# EAGLE design geigerDC3 (EAGLE 9.3.0)
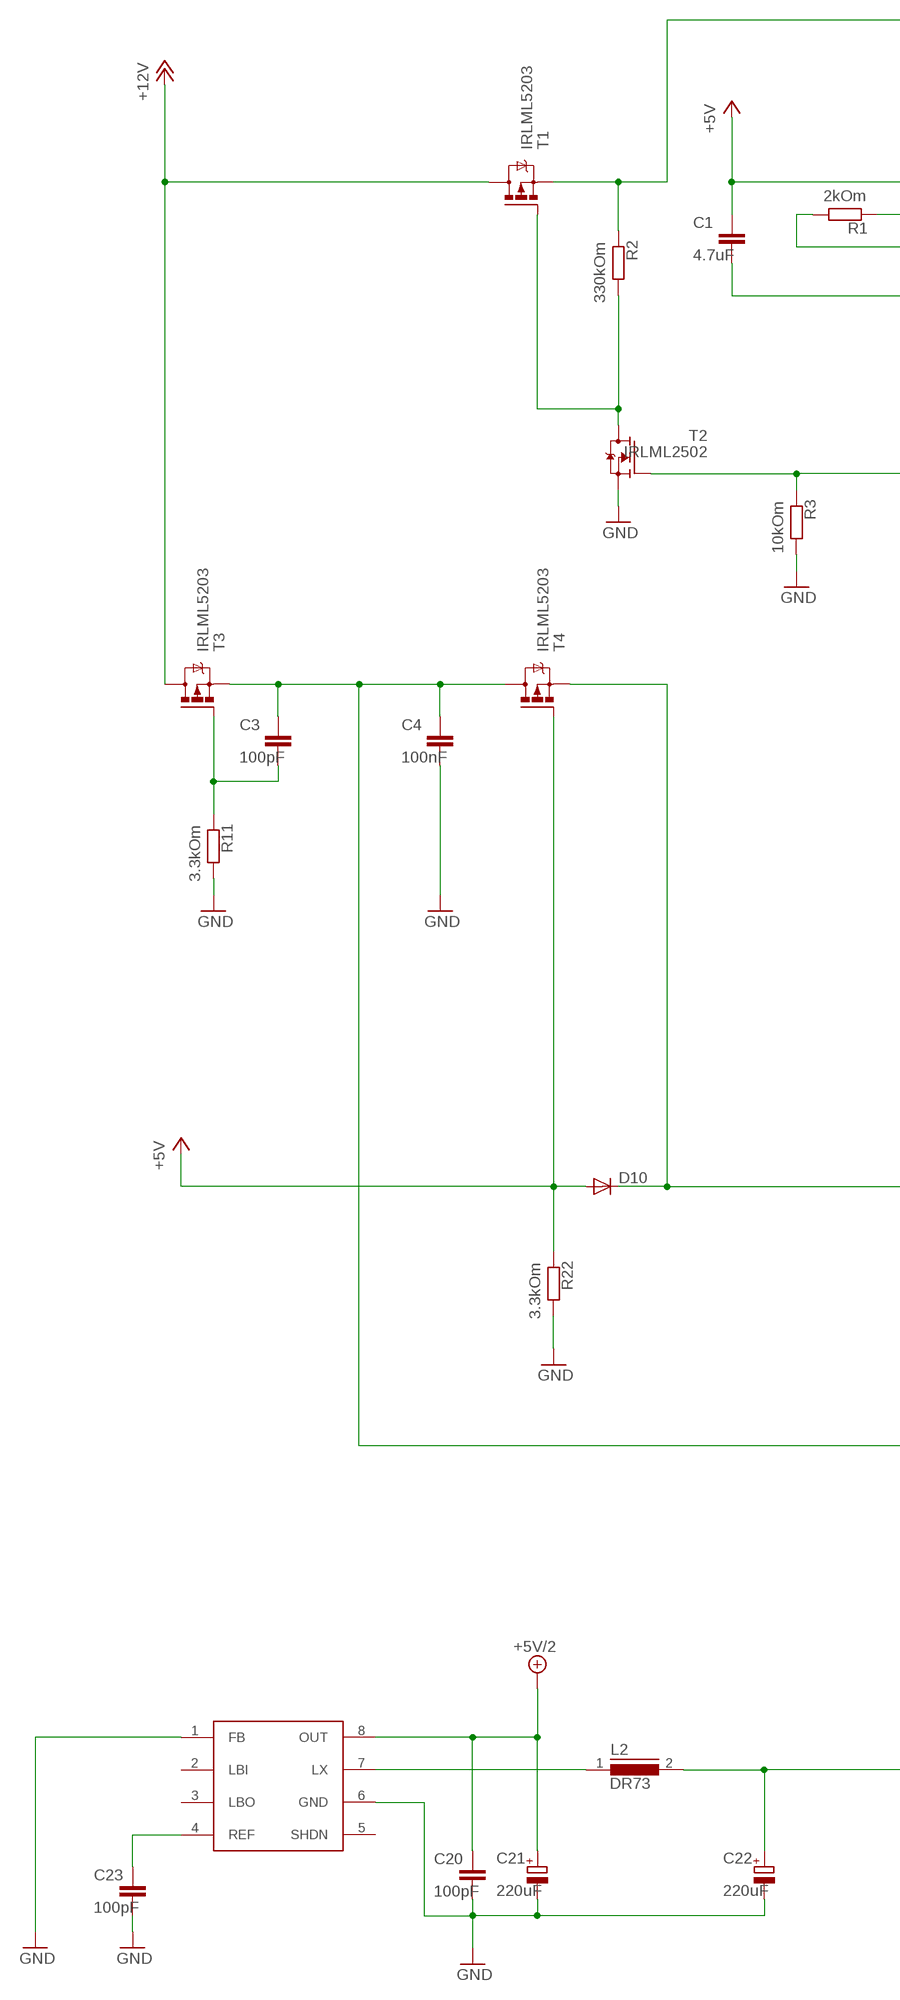
[diagram p0: schematic, sheet 1, part 1 of 3]
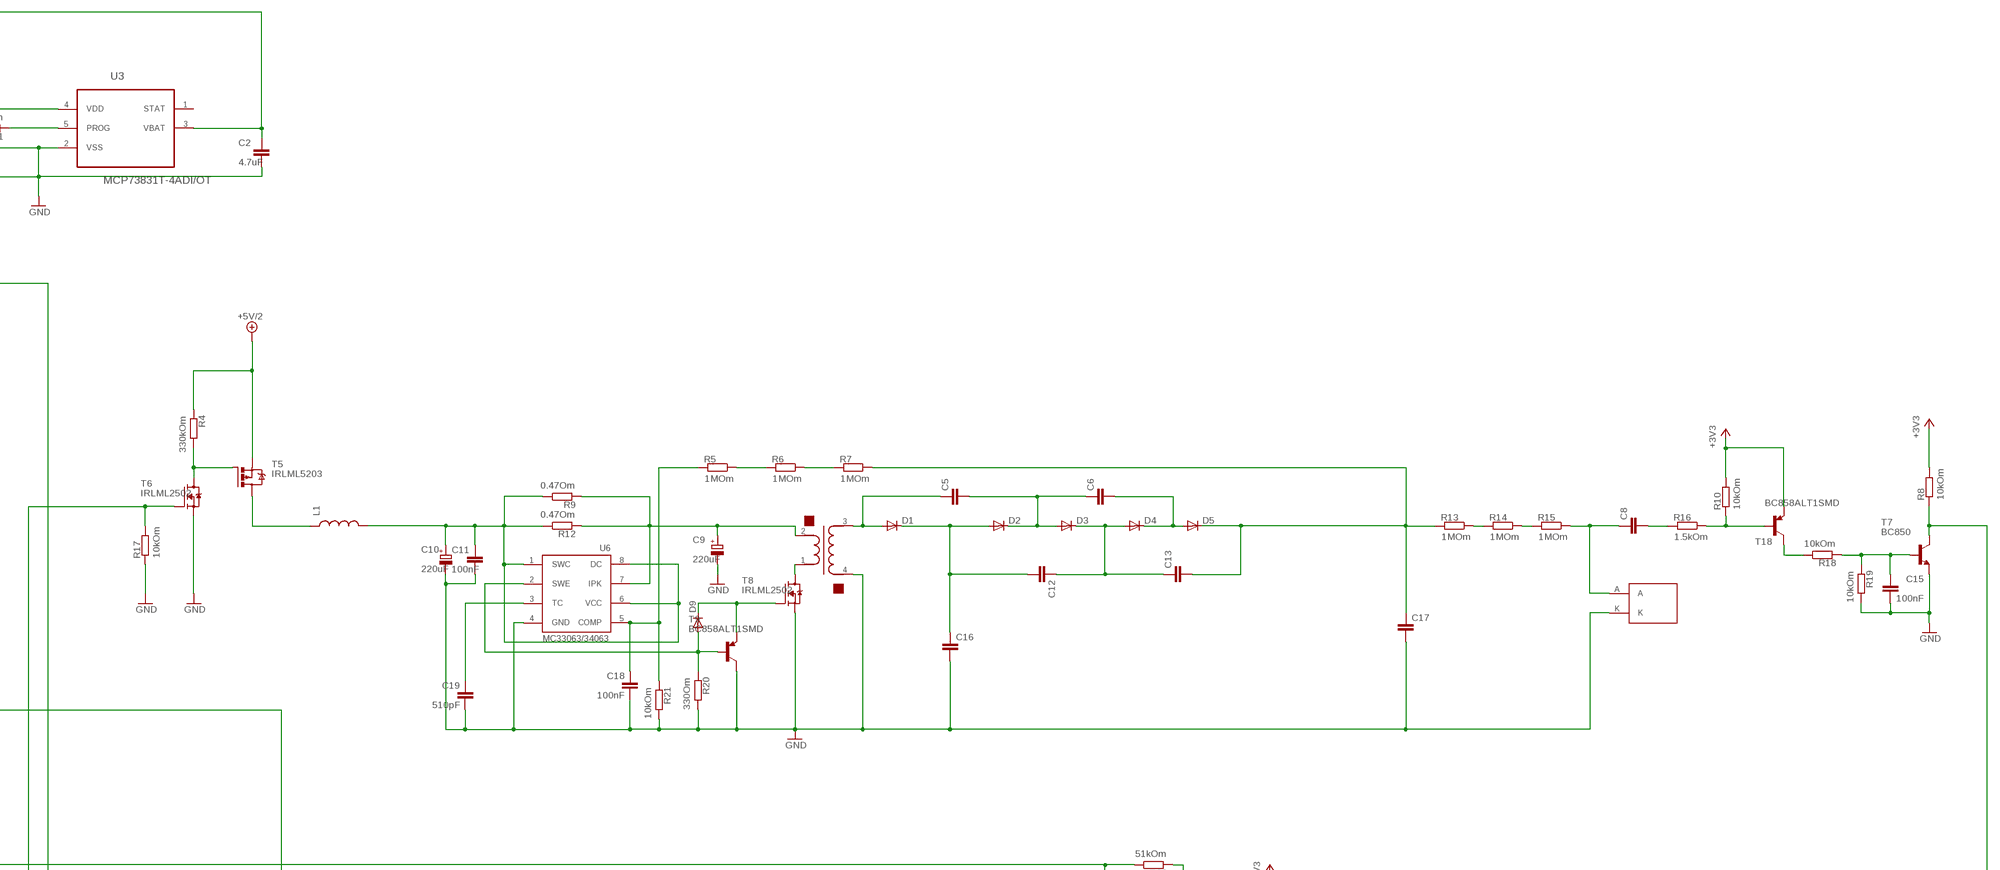
[diagram p1: schematic, sheet 1, part 2 of 3]
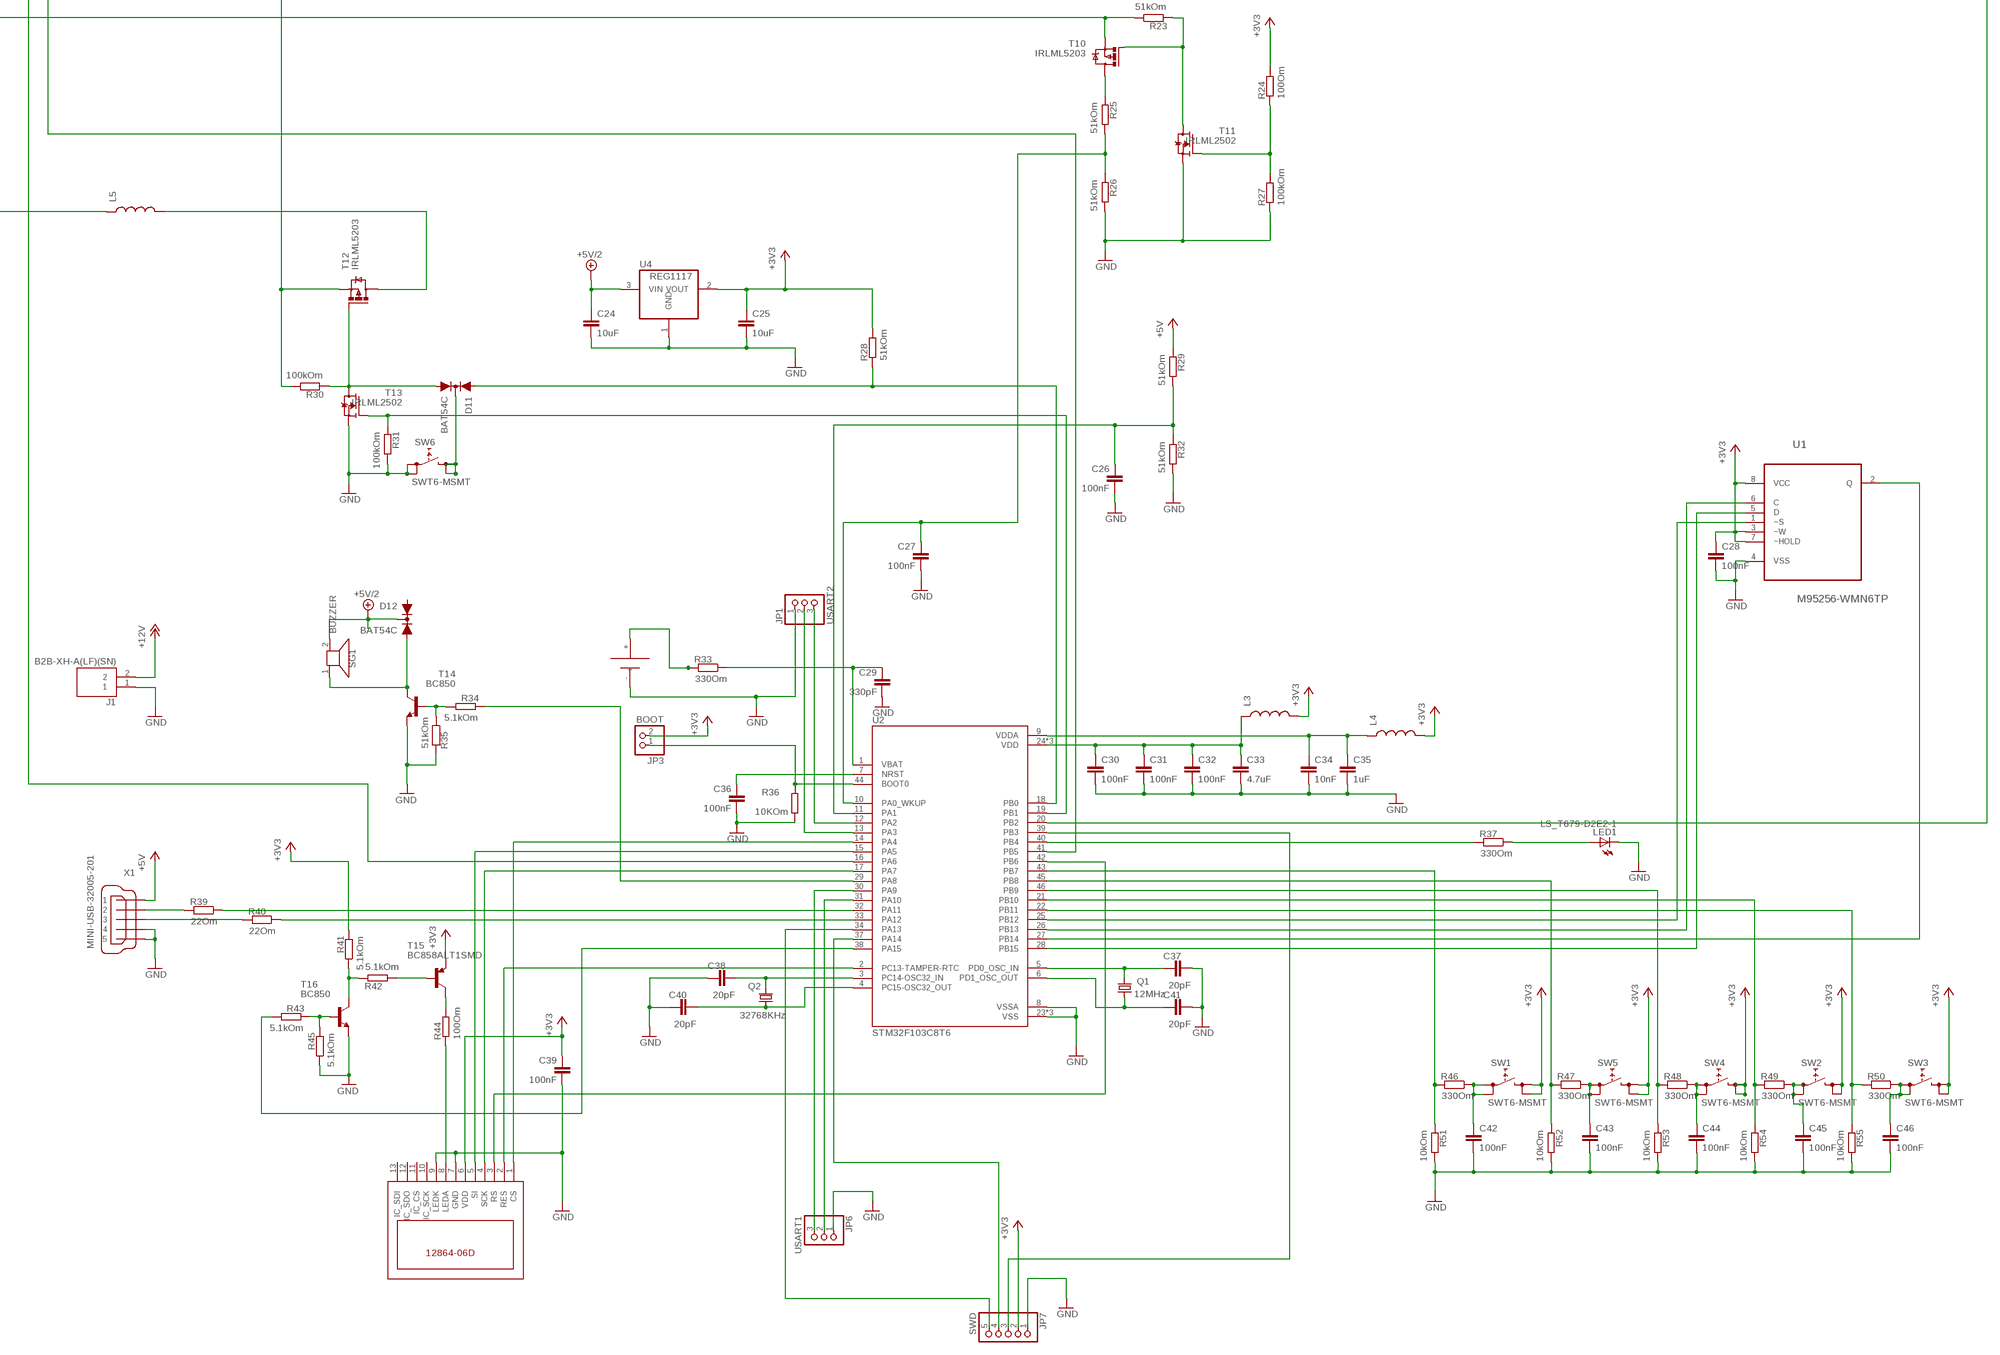
[diagram p2: schematic, sheet 1, part 3 of 3]

## Parts
C1  4.7uF  C-EUC0402  [C0402]
C2  4.7uF  C-EUC0402  [C0402]
C3  100pF  C-EUC0402  [C0402]
C4  100nF  C-EUC0402  [C0402]
C5  C-EUC2220K  [C2220K]
C6  C-EUC2220K  [C2220K]
C8  C-EU050-024X044  [C050-024X044]
C9  220uF  CPOL-EUC/6032-28W  [C/6032-28W]
C10  220uF  CPOL-EUC/6032-28W  [C/6032-28W]
C11  100nF  C-EUC0402  [C0402]
C12  C-EUC2220K  [C2220K]
C13  C-EUC2220K  [C2220K]
C15  100nF  C-EUC0402  [C0402]
C16  C-EUC2220K  [C2220K]
C17  C-EUC2220K  [C2220K]
C18  100nF  C-EUC0402  [C0402]
C19  510pF  C-EUC0402  [C0402]
C20  100pF  C-EUC0402  [C0402]
C21  220uF  CPOL-EUC/6032-28W  [C/6032-28W]
C22  220uF  CPOL-EUC/6032-28W  [C/6032-28W]
C23  100pF  C-EUC0402  [C0402]
C24  10uF  C-EUC0402  [C0402]
C25  10uF  C-EUC0402  [C0402]
C26  100nF  C-EUC0402  [C0402]
C27  100nF  C-EUC0402  [C0402]
C28  100nF  C-EUC0402  [C0402]
C29  330pF  C-EUC0402  [C0402]
C30  100nF  C-EUC0402  [C0402]
C31  100nF  C-EUC0402  [C0402]
C32  100nF  C-EUC0402  [C0402]
C33  4.7uF  C-EUC0402  [C0402]
C34  10nF  C-EUC0402  [C0402]
C35  1uF  C-EUC0402  [C0402]
C36  100nF  C-EUC0402  [C0402]
C37  20pF  C-EUC0402  [C0402]
C38  20pF  C-EUC0402  [C0402]
C39  100nF  C-EUC0402  [C0402]
C40  20pF  C-EUC0402  [C0402]
C41  20pF  C-EUC0402  [C0402]
C42  100nF  C-EUC0402  [C0402]
C43  100nF  C-EUC0402  [C0402]
C44  100nF  C-EUC0402  [C0402]
C45  100nF  C-EUC0402  [C0402]
C46  100nF  C-EUC0402  [C0402]
D1  DIODE-DO214BA  [DO214BA]
D2  DIODE-DO214BA  [DO214BA]
D3  DIODE-DO214BA  [DO214BA]
D4  DIODE-DO214BA  [DO214BA]
D5  DIODE-DO214BA  [DO214BA]
D9  DIODE-DO-214AC  [DO-214AC]
D10  DIODE-DO-214AC  [DO-214AC]
D11  BAT54C  [SOT23-R]
D12  BAT54C  [SOT23-R]
J1  B2B-XH-A(LF)(SN)  [JST_B2B-XH-A(LF)(SN)]
JP1  USART2  PINHD-1X3  [1X03]
JP3  BOOT  PINHD-1X2  [1X02]
JP6  USART1  PINHD-1X3  [1X03]
JP7  SWD  PINHD-1X5  [1X05]
L1  INDUCTOR0805  [0805]
L2  DR73  [DR73]
L3  INDUCTOR0805  [0805]
L4  INDUCTOR0805  [0805]
L5  INDUCTOR0805  [0805]
LED1  LS_T679-D2E2-1  [PLCC2]
Q1  12MHz  CRYSTALHC49UP  [HC49UP]
Q2  32768KHz  KX-327-S  [8.2X3.8]
R1  2kOm  R-EU_R0402  [R0402]
R2  330kOm  R-EU_R0402  [R0402]
R3  10kOm  R-EU_R0402  [R0402]
R4  330kOm  R-EU_R0402  [R0402]
R5  1MOm  R-EU_R0805  [R0805]
R6  1MOm  R-EU_R0805  [R0805]
R7  1MOm  R-EU_R0805  [R0805]
R8  10kOm  R-EU_R0402  [R0402]
R9  0.47Om  R-EU_R0805  [R0805]
R10  10kOm  R-EU_R0402  [R0402]
R11  3.3kOm  R-EU_R0402  [R0402]
R12  0.47Om  R-EU_R0805  [R0805]
R13  1MOm  R-EU_R0805  [R0805]
R14  1MOm  R-EU_R0805  [R0805]
R15  1MOm  R-EU_R0805  [R0805]
R16  1.5kOm  R-EU_R0402  [R0402]
R17  10kOm  R-EU_R0402  [R0402]
R18  10kOm  R-EU_R0402  [R0402]
R19  10kOm  R-EU_R0402  [R0402]
R20  330Om  R-EU_R0402  [R0402]
R21  10kOm  R-EU_R0805  [R0805]
R22  3.3kOm  R-EU_R0402  [R0402]
R23  51kOm  R-EU_R0402  [R0402]
R24  100Om  R-EU_R0402  [R0402]
R25  51kOm  R-EU_R0402  [R0402]
R26  51kOm  R-EU_R0402  [R0402]
R27  100kOm  R-EU_R0402  [R0402]
R28  51kOm  R-EU_R0402  [R0402]
R29  51kOm  R-EU_R0402  [R0402]
R30  100kOm  R-EU_R0402  [R0402]
R31  100kOm  R-EU_R0402  [R0402]
R32  51kOm  R-EU_R0402  [R0402]
R33  330Om  R-EU_R0402  [R0402]
R34  5.1kOm  R-EU_R0402  [R0402]
R35  51kOm  R-EU_R0402  [R0402]
R36  10KOm  R-EU_R0402  [R0402]
R37  330Om  R-EU_R0402  [R0402]
R39  22Om  R-EU_R0402  [R0402]
R40  22Om  R-EU_R0402  [R0402]
R41  5.1kOm  R-EU_R0402  [R0402]
R42  5.1kOm  R-EU_R0402  [R0402]
R43  5.1kOm  R-EU_R0402  [R0402]
R44  100Om  R-EU_R0805  [R0805]
R45  5.1kOm  R-EU_R0402  [R0402]
R46  330Om  R-EU_R0402  [R0402]
R47  330Om  R-EU_R0402  [R0402]
R48  330Om  R-EU_R0402  [R0402]
R49  330Om  R-EU_R0402  [R0402]
R50  330Om  R-EU_R0402  [R0402]
R51  10kOm  R-EU_R0402  [R0402]
R52  10kOm  R-EU_R0402  [R0402]
R53  10kOm  R-EU_R0402  [R0402]
R54  10kOm  R-EU_R0402  [R0402]
R55  10kOm  R-EU_R0402  [R0402]
SG1  BUZZER  [BUZZER]
SW1  SWT6-MSMT  [SWT6-M]
SW2  SWT6-MSMT  [SWT6-M]
SW3  SWT6-MSMT  [SWT6-M]
SW4  SWT6-MSMT  [SWT6-M]
SW5  SWT6-MSMT  [SWT6-M]
SW6  SWT6-MSMT  [SWT6-M]
T1  IRLML5203  [MICRO3]
T2  IRLML2502  [SOT23]
T3  IRLML5203  [MICRO3]
T4  IRLML5203  [MICRO3]
T5  IRLML5203  [MICRO3]
T6  IRLML2502  [SOT23]
T7  BC850  [SOT23]
T8  IRLML2502  [SOT23]
T9  BC858ALT1SMD  [SOT23-BEC]
T10  IRLML5203  [MICRO3]
T11  IRLML2502  [SOT23]
T12  IRLML5203  [MICRO3]
T13  IRLML2502  [SOT23]
T14  BC850  [SOT23]
T15  BC858ALT1SMD  [SOT23-BEC]
T16  BC850  [SOT23]
T18  BC858ALT1SMD  [SOT23-BEC]
TR1  TRANSFORMER  [TRANSFORMER]
TUBE  TUBE  [XH-B3B]
U1  M95256-WMN6TP  [SOIC127P600X175-8N]
U2  STM32F103C8T6  [QFP50P900X900X160-48N]
U3  MCP73831T-4ADI/OT  [SOT95P280X145-5N]
U4  REG1117  [SOT223]
U5  L6920DTR  [TSSOP8]
U6  MC33063/MC34063D  [SO08]
U$1  DS1092-10-W6L  [DS1092-10-W6L]
U$5  12864-06D  [12864-06D]
X1  MINI-USB-32005-201  [32005-201]

## Nets
+3V3: C25.1 C28.1 C39.1 JP3.2 JP7.2 L3.2 L4.2 R8.1 R10.1 R24.1 R28.1 R41.2 SW1.3 SW1.4 SW2.3 SW2.4 SW3.3 SW3.4 SW4.3 SW4.4 SW5.3 SW5.4 T15.E T18.E U1.3(~W) U1.7(~HOLD) U1.8(VCC) U4.2(VOUT) U$5.6(VDD)
+5V: C1.1 D10.2(A) R22.2 R29.2 T4.1(G) U3.4(VDD) X1.1
+5V/2: C20.1 C21.+ C24.1 D12.3(C) R4.2 SG1.2 T5.2(S) U4.3(VIN) U5.8(OUT)
+12V: J1.2 T1.3(D) T3.3(D)
GND: C1.2 C2.2 C4.2 C9.- C10.- C11.2 C15.2 C16.2 C17.2 C18.2 C19.2 C20.2 C21.- C22.- C23.2 C24.2 C25.2 C26.2 C27.2 C28.2 C29.2 C30.2 C31.2 C32.2 C33.2 C34.2 C35.2 C36.2 C37.2 C38.1 C39.2 C40.1 C41.2 C42.2 C43.2 C44.2 C45.2 C46.2 J1.1 JP1.1 JP6.1 JP7.1 LED1.C R1.1 R3.1 R11.1 R17.2 R19.1 R20.1 R21.1 R22.1 R26.1 R27.2 R31.1 R32.1 R35.2 R36.1 R45.1 R51.1 R52.1 R53.1 R54.1 R55.1 SW6.1 SW6.2 T2.2(S) T6.2(S) T7.2(E) T8.2(S) T9.C T11.2(S) T13.2(S) T14.2(E) T16.2(E) TR1.4 TUBE.K U1.4(VSS) U2.8(VSSA) U2.23(VSS) U2.35(VSS) U2.47(VSS) U3.2(VSS) U4.1(GND) U5.1(FB) U5.6(GND) U6.4(GND) U$1.- U$5.7(GND) U$5.9(LEDK) X1.4 X1.5
N$1: C30.1 C31.1 C32.1 C33.1 L3.1 U2.24(VDD) U2.36(VDD) U2.48(VDD)
N$2: C41.1 Q1.1 U2.6(PD1_OSC_OUT)
N$3: C34.1 C35.1 L4.1 U2.9(VDDA)
N$4: C37.1 Q1.2 U2.5(PD0_OSC_IN)
N$5: C38.2 Q2.4 U2.3(PC14-OSC32_IN)
N$6: C36.1 U2.7(NRST)
N$7: C40.2 Q2.1 U2.4(PC15-OSC32_OUT)
N$8: C29.1 R33.1 U2.1(VBAT)
N$9: JP3.1 R36.2 U2.44(BOOT0)
N$10: R33.2 U$1.+
N$11: R40.1 U2.33(PA12)
N$12: R39.1 U2.32(PA11)
N$13: R39.2 X1.2
N$14: R40.2 X1.3
N$15: C2.1 R2.2 T1.2(S) U3.3(VBAT)
N$16: R31.2 T13.1(G) U2.19(PB1)
N$17: D11.2(A2) R30.2 T12.1(G) T13.3(D)
N$18: D11.3(C) SW6.3 SW6.4
N$19: D11.1(A1) R28.2 U2.18(PB0)
N$20: R3.2 T2.1(G) U2.41(PB5)
N$21: C3.2 R11.2 T3.1(G)
N$22: D10.1(C) R30.1 T4.2(S) T12.2(S)
N$23: L1.1 T5.3(D)
N$24: C3.1 C4.1 R23.1 T3.2(S) T4.3(D) T10.2(S)
N$25: C10.+ C11.1 L1.2 R9.1 R12.1 U6.1(SWC) U6.6(VCC) U6.8(DC)
N$26: C13.2 C17.1 D5.C R7.1 R13.2
N$27: C9.+ R9.2 R12.2 TR1.2 U6.7(IPK)
N$28: R4.1 T5.1(G) T6.3(D)
N$29: D9.1(C) T8.1(G) T9.E
N$30: T8.3(D) TR1.1
N$31: R17.1 T6.1(G) U2.16(PA6)
N$32: C18.1 R5.2 R21.2 U6.5(COMP)
N$33: C5.1 D1.A TR1.3
N$34: D9.2(A) R20.2 T9.B U6.2(SWE)
N$35: R5.1 R6.2
N$36: R6.1 R7.2
N$37: R44.2 U$5.8(LEDA)
N$38: C43.1 R47.1 SW5.1 SW5.2
N$39: R24.2 R27.1 T11.1(G)
N$40: C19.1 U6.3(TC)
N$41: JP6.2 U2.31(PA10)
N$42: C27.1 R25.1 R26.2 U2.10(PA0_WKUP)
N$43: R23.2 T10.1(G) T11.3(D)
N$44: R2.1 T1.1(G) T2.3(D)
N$46: C12.2 C16.1 D1.C D2.A
N$47: C5.2 C6.1 D2.C D3.A
N$48: C12.1 C13.1 D3.C D4.A
N$49: C6.2 D4.C D5.A
N$50: C44.1 R48.1 SW4.1 SW4.2
N$52: JP1.3 U2.12(PA2)
N$53: JP1.2 U2.13(PA3)
N$54: R25.2 T10.3(D)
N$55: JP6.3 U2.30(PA9)
N$58: R13.1 R14.2
N$59: R14.1 R15.2
N$60: C8.1 R15.1 TUBE.A
N$61: C8.2 R16.2
N$62: R10.2 R16.1 T18.B
N$63: JP7.5 U2.34(PA13)
N$64: R18.1 T18.C
N$65: C15.1 R18.2 R19.2 T7.1(B)
N$66: R8.2 T7.3(C) U2.20(PB2)
N$67: JP7.4 U2.37(PA14)
N$68: JP7.3 U2.39(PB3)
N$69: U1.5(D) U2.28(PB15)
N$70: U1.2(Q) U2.27(PB14)
N$71: U1.6(C) U2.26(PB13)
N$72: R49.2 R54.2 U2.21(PB10)
N$73: C46.1 R50.1 SW3.1 SW3.2
N$74: U1.1(~S) U2.25(PB12)
N$76: C45.1 R49.1 SW2.1 SW2.2
N$77: C42.1 R46.1 SW1.1 SW1.2
N$78: C26.1 R29.1 R32.2 U2.11(PA1)
N$79: R46.2 R51.2 U2.43(PB7)
N$80: R47.2 R52.2 U2.45(PB8)
N$81: R48.2 R53.2 U2.46(PB9)
N$83: R50.2 R55.2 U2.22(PB11)
N$84: R34.2 U2.29(PA8)
N$85: D12.2(A2) SG1.1 T14.3(C)
N$86: U2.14(PA4) U$5.1(CS)
N$87: R34.1 R35.1 T14.1(B)
N$88: U2.15(PA5) U$5.5(SI)
N$89: U2.17(PA7) U$5.4(SCK)
N$90: R44.1 T15.C
N$91: C22.+ L2.2 L5.1
N$92: R42.1 T15.B
N$93: R41.1 R42.2 T16.3(C)
N$94: R37.2 U2.40(PB4)
N$95: R43.2 R45.2 T16.1(B)
N$96: LED1.A R37.1
N$97: R43.1 U2.38(PA15)
N$98: U2.2(PC13-TAMPER-RTC) U$5.2(RES)
N$99: U2.42(PB6) U$5.3(RS)
N$100: R1.2 U3.5(PROG)
N$101: C23.1 U5.4(REF)
N$105: L2.1 U5.7(LX)
N$108: L5.2 T12.3(D)
Unconnected: D12.1(A1) U3.1(STAT) U5.2(LBI) U5.3(LBO) U5.5(SHDN) U$5.10(IC_SCK) U$5.11(IC_CS) U$5.12(IC_SDO) U$5.13(IC_SDI)

## Library data of the parts
C1-C4 C8 C11 C15 C18-C20 C23-C46 = rcl:C-EU: CAPACITOR, European symbol; SPICEPREFIX: C
C5 C6 C12 C13 C16 C17 = rcl:C-EU: CAPACITOR, European symbol
C9 C10 C21 C22 = rcl:CPOL-EU: POLARIZED CAPACITOR, European symbol
D1-D5 = diode:DIODE-: DIODE
D9 D10 = dp_devices:DIODE: Various Diode Packages
D11 D12 = BAT54C:BAT54C: BAT54C Schottky Diodes (Common Cathode) 30V 200mA, SOT-23 Package Digikey: BAT54CFSCT-ND; AVAILABILITY: Unavailable; DESCRIPTION: Diode Array 1 Pair Common Cathode Schottky 30V 200mA Surface Mount TO-236-3, SC-59, SOT-23-3; MF: ON Semiconductor; MP: BAT54C; PACKAGE: SOT-23-3 ON Semiconductor; PRICE: None
J1 = B2B-XH-A_LF__SN_:B2B-XH-A(LF)(SN): XH Series 2 Position 2.5 mm Pitch Through Hole Top Entry Shrouded Header; AVAILABILITY: Unavailable; DESCRIPTION: Connector Header Through Hole 2 position 0.098 _2.50mm_; MF: JST Sales; MP: B2B-XH-A_LF__SN_; PACKAGE: None; PRICE: None
JP1 JP6 = pinhead:PINHD-1X3: PIN HEADER
JP3 = pinhead:PINHD-1X2: PIN HEADER
JP7 = pinhead:PINHD-1X5: PIN HEADER
L1 L3-L5 = SparkFun:INDUCTOR: Inductors Basic Inductor/Choke - 0603 and 1206. Footprints are not proven and vary greatly between part numbers.
L2 = inductors:DR73: High Power Density, High Efficiency, Shielded Inductors Source: coiltronics_dr_series.pdf; SPICEPREFIX: L
LED1 = led:*_T679-?-1: LC TOPLED® Low Current LED Source: http://catalog.osram-os.com .. LG_LS_LY_T679_OBS.pdf; COLOR: super-red
Q1 = crystal:CRYSTAL: CRYSTAL; OC_FARNELL: unknown; OC_NEWARK: unknown
Q2 = crystal-geyer_V1_0:KX-327: Tuning Fork Crystals (kHz) SMD: KX327 - Serie Model Size l/w/h [mm] Frequency Range Frequency Stability Temp. Range [°C] Load Capacitance AECQ 200 availabel Datasheet KX-327VT KX-327FT KX-327RT KX-327NHT KX-327NHF KX-327L KX-327S 1.25/1.05/0.5 1.6/1.0/0.5 2.0/1.2/0.6 3.2/1.5/0.8 3.2/1.5/0.8 7.0/1.5/1.4 8.2/3.8/2.5 32,768 kHz 32,768 kHz 32,768 kHz 32,768 kHz 32,768 kHz 32,768 kHz 32,768 kHz ±10 … ±20ppm ±10 … ±20ppm ±10 … ±20ppm ±10 … ±20ppm ±10 … ±20ppm ±10 … ±20ppm ±5 … ±20ppm (*) -40°C …+85°C (*) -40°C …+85°C (*) -40°C …+85°C (*) -40°C …+85°C (*) -40°C …+125°C (*) -40°C …+85°C (*) -40°C …+85°C 7/9/12,5 7/9/12,5 7/9/12,6 7/9/12,5 9/12,5 7/9/12,5 6/12,5 - - - - yes - - KX-327VT.pdf <http://www.geyer-electronic.de/uploads/tx_userartikelfrequenz/GEYER-KX-327VT.pdf> KX-327FT.pdf <http://www.geyer-electronic.de/uploads/tx_userartikelfrequenz/GEYER-KX-327FT.pdf> KX-327RT.pdf <http://www.geyer-electronic.de/uploads/tx_userartikelfrequenz/GEYER-KX-327RT.pdf> KX-327NHT.pdf <http://www.geyer-electronic.de/uploads/tx_userartikelfrequenz/GEYER-KX-327NHT.pdf> KX-327NHF.pdf <http://www.geyer-electronic.de/uploads/tx_userartikelfrequenz/GEYER-KX-327NHF.pdf> KX-327L.pdf <http://www.geyer-electronic.de/uploads/tx_userartikelfrequenz/GEYER-KX-327L.pdf> KX-327S.pdf <http://www.geyer-electronic.de/uploads/tx_userartikelfrequenz/GEYER-KX-327S.pdf> <http://www.geyer-electronic.de/fileadmin/template/img/logo-geyer-electronic.png> Details see: http://www.geyer-electronic.de/Frequenz-Produkte.9.0.html Created 2016-06-07, Hans Locher 2016 (C) Geyer Quartz Technology KX327VT,KX327FT,KX327RT,KX327NHT,KX327NHF,KX327S,KX327L;125105;1610;2012;3215;7015;8238;1,25x1,05,1.25x1.05;1,6x1,0,1.6x1.0;2,0x1,2,2.0x1.2;3,2x1,5,3.2x1.5;8,2x3,8,8.2x3.8,7.0x1.5,7,0x1,532.768kHz
R1-R4 R8 R10 R11 R16-R20 R22-R37 R39-R43 R45-R55 = rcl:R-EU_: RESISTOR, European symbol; SPICEPREFIX: R
R5-R7 R9 R12-R15 R21 R44 = rcl:R-EU_: RESISTOR, European symbol
SG1 = buzzer:BUZZER
SW1-SW6 = tactile_switch:SWT6-M
T1 T3-T5 T10 T12 = transistor-power:IRLML5203: HEXFET P-Channel Power MOSFET
T2 T6 T8 T11 T13 = IRLML2502:IRLML2502; AVAILABILITY: Unavailable; DESCRIPTION: N-Channel 20V 4.2A _Ta_ 1.25W _Ta_ Surface Mount Micro3™/SOT-23; MF: Infineon Technologies; MP: IRLML2502; PACKAGE: SOT-23-3 International Rectifier; PRICE: None
T7 T14 T16 = transistor:BC850: NPN TRANSISTOR
T9 T15 T18 = transistor-pnp:BC858*: PNP Transistror
TR1 = transformer:TRANSFORMER
TUBE = XH:TUBE
U1 = M95256-WMN6TP:M95256-WMN6TP: EEPROM; AVAILABILITY: Unavailable; DESCRIPTION: EEPROM Serial-SPI 256K-bit 32K x 8 3.3V/5V 8-Pin SO N T/R; MF: STMicroelectronics; MP: M95256-WMN6TP; PACKAGE: SO-8 STMicroelectronics; PRICE: None
U2 = STM32F103C8T6:STM32F103C8T6: Mainstream Performance line, ARM Cortex-M3 MCU with 64 Kbytes Flash, 72 MHz CPU, motor control, USB and CAN; AVAILABILITY: Unavailable; DESCRIPTION: ARM® Cortex®-M3 STM32F1 Microcontroller IC 32-Bit 72MHz 64KB _64K x 8_ FLASH; MF: STMicroelectronics; MP: STM32F103C8T6; PACKAGE: LQFP-48 STMicroelectronics; PRICE: None
U3 = MCP73831T-4ADI_OT:MCP73831T-4ADI/OT: Charge Management Controller; AVAILABILITY: Unavailable; DESCRIPTION: Charger IC Lithium Ion/Polymer SOT-23-5; MF: Microchip; MP: MCP73831T-4ADI/OT; PACKAGE: SOT-23-5 Microchip; PRICE: None
U4 = burr-brown:REG1117: 800mA and 1A Low Dropout (LDO) Positive Regulator 1.8V, 2.5V, 2.85V, 3.3V, 5V, and Adj; MPN: REG1117; OC_FARNELL: 1097566; OC_NEWARK: 14P6981
U5 = L6902DTR:L6920DTR
U6 = adafruit:MC33063/MC34063: MC33063 and MC34063 Basic DC/DC converter with internal power-NPN transistor, 100KHz, 1.5A peak switch current. 3-40 input/output.
U$1 = batteries:DS1092-10-W6L
U$5 = 12864-06D:12864-06D
X1 = con-cypressindustries:MINI-USB-: MINI USB-B Conector Source: www.cypressindustries.com; OC_FARNELL: unknown; OC_NEWARK: unknown

## Board
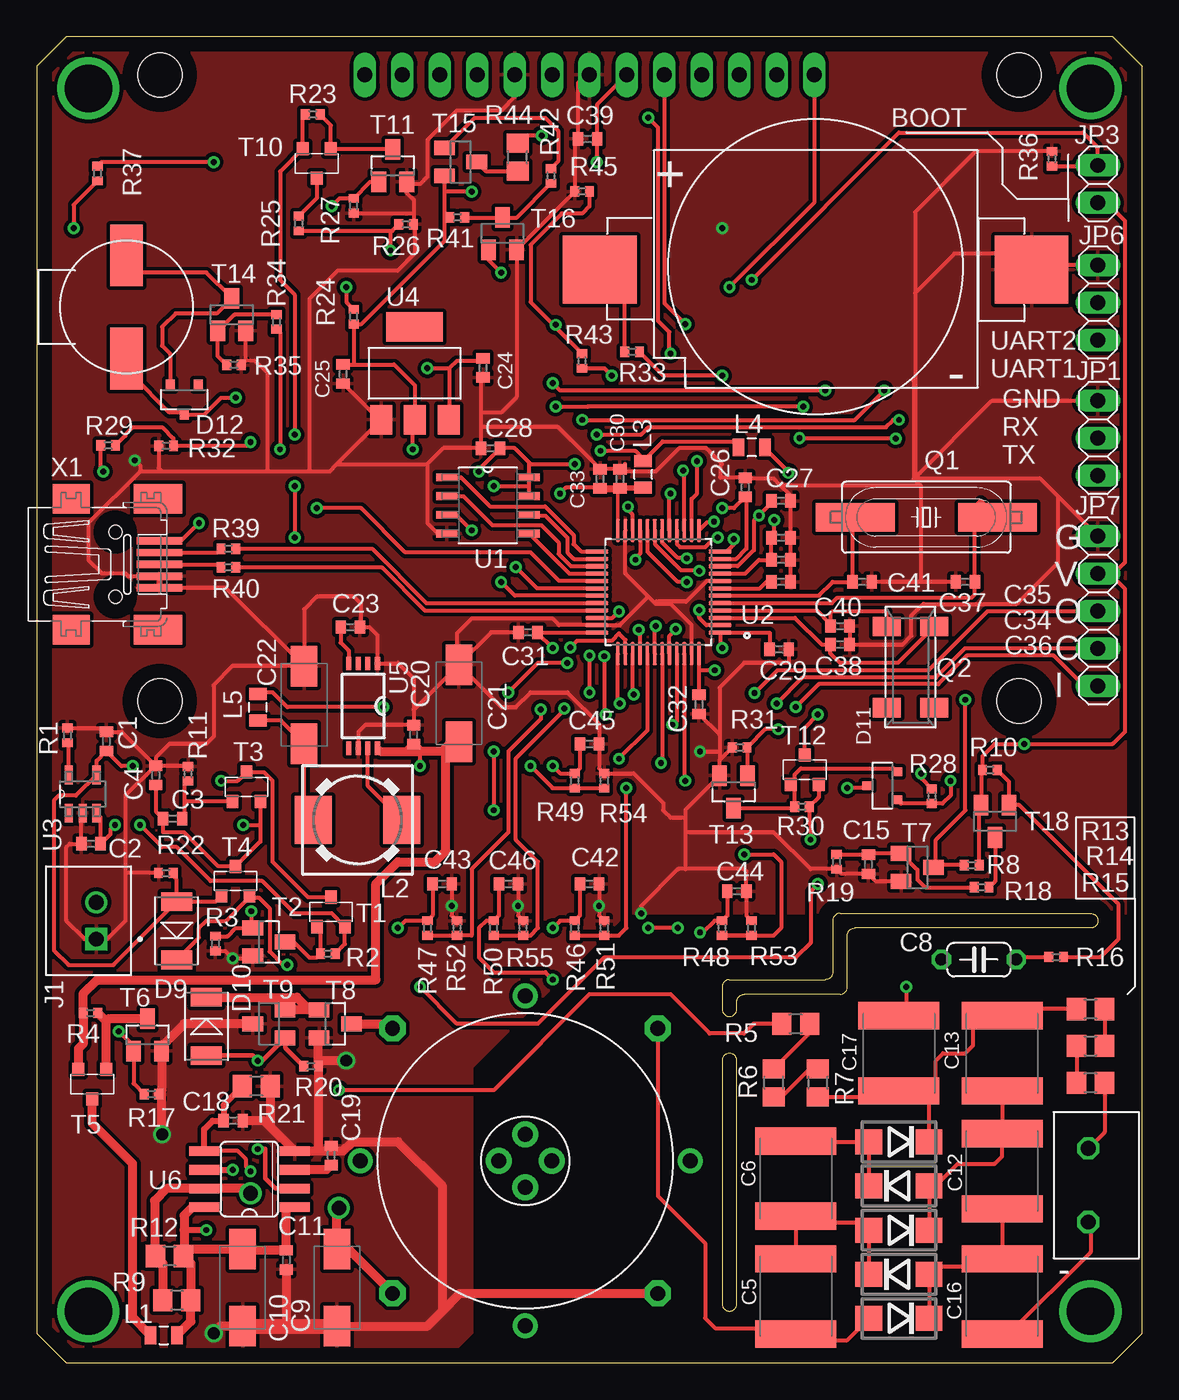
[diagram p3: board, top side]
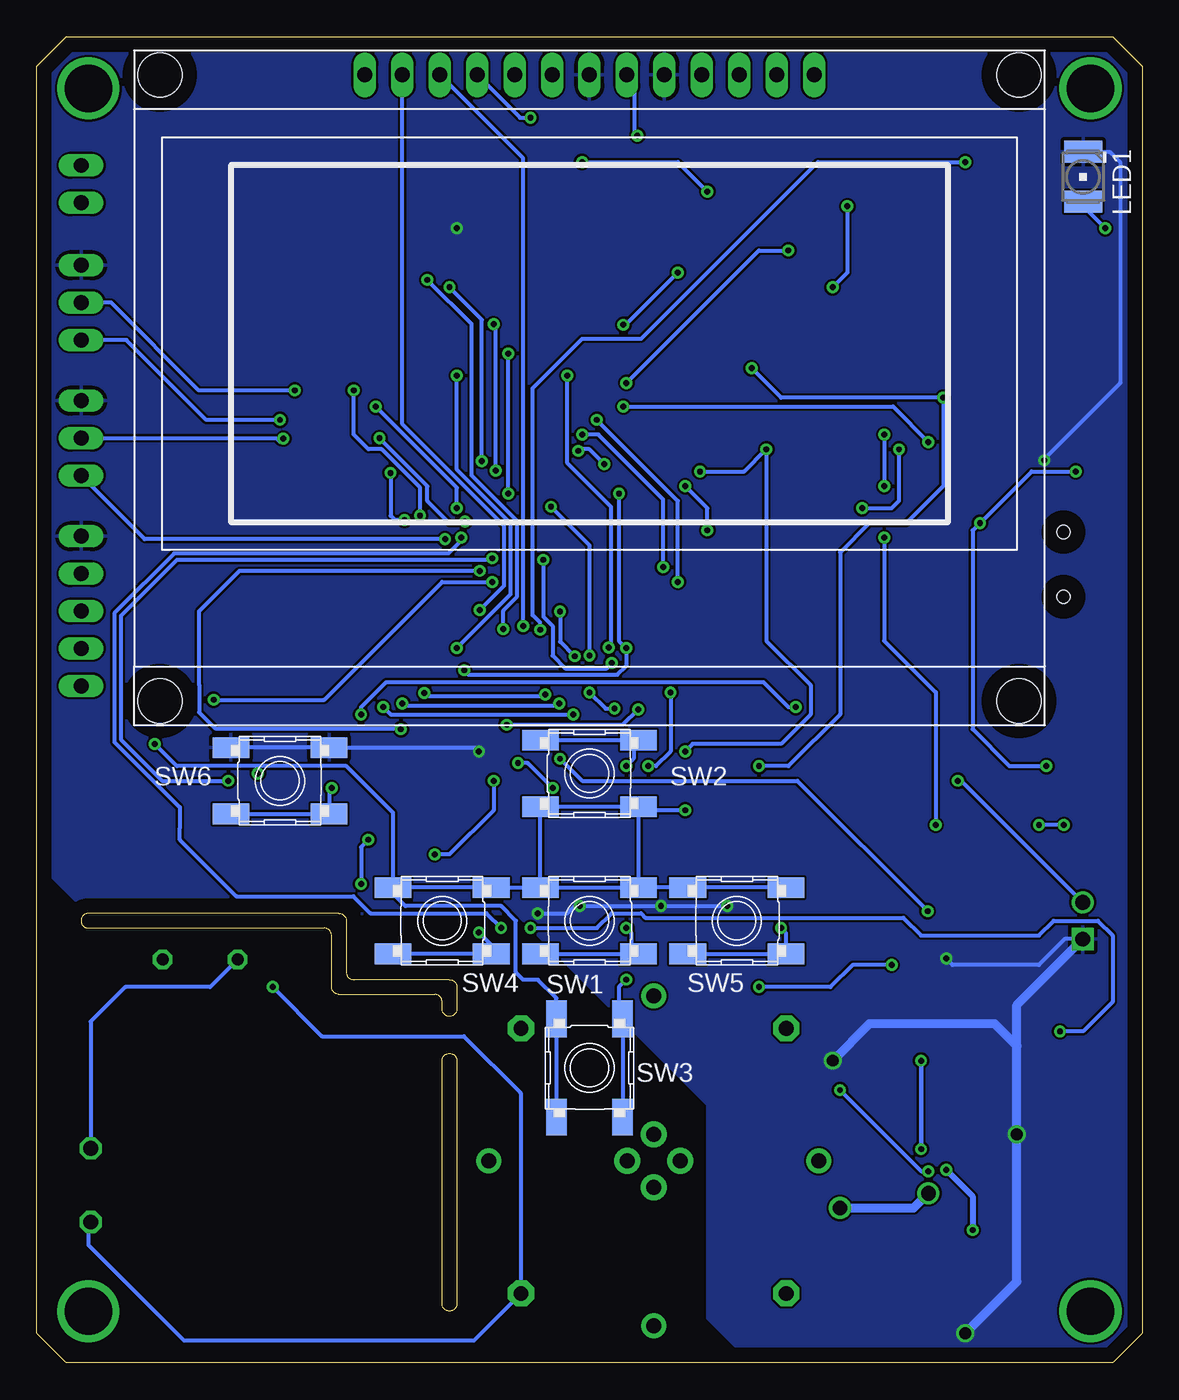
[diagram p4: board, bottom side, seen from below]

Size 75 x 90 mm. Coordinates in mm from the lower left corner, seen from the top.
Outline: 2,0 73,0 75,2 75,88 73,90 2,90 0,88 0,2 2,0
Outline: 46.5,20.5 46.5,4 arc180 47.5,4 47.5,20.5 arc180 46.5,20.5
Outline: 47,26 53.5,26 arc90 54,26.5 54,30 arc-90 54.5,30.5 71.5,30.5 arc-180 71.5,29.5 55.5,29.5 arc90 55,29 55,25.5 arc-90 54.5,25 48,25 arc90 47.5,24.5 47.5,24 arc-90 47,23.5 arc-90 46.5,24 46.5,25.5 arc-90 47,26
Copper layers (1*16): Top 0.035mm / dielectric 1.5mm / Bottom 0.035mm
Design rules "default": minimum track width 6mil, minimum drill 0.35mm, track to track 6mil, track to pad 6mil, pad to pad 6mil, via to via 6mil, smd to smd 6mil, copper to edge 40mil, drill to drill 6mil, minimum pad ring 10mil, minimum via ring 8mil, stop-mask expansion 4mil, vias tented up to drill 0mil, thermal gap 10mil

### Footprints (pad centres in the part's own frame; a part is rotated, then mirrored left to right if it is on the bottom)
C0402 = smd 0.7 x 0.9: 1 -0.65,0; 2 0.65,0
C2220K = smd 1.85 x 5.5: 1 -2.55,0; 2 2.55,0
C050-024X044 = drill 0.813 octagon: 1 -2.54,0; 2 2.54,0
C/6032-28W = smd 2.75 x 1.8: + 2.625,0; - -2.625,0
DO214BA = smd 1.8 x 1.7: A 2.05,0; C -2.05,0
DO-214AC = smd 1.27 x 2.1: 1 -1.98,0; 2 1.98,0
SOT23-R = smd 0.6 x 0.7: 1 -0.95,-1; 2 0.95,-1; 3 0,1
JST_B2B-XH-A(LF)(SN) = drill 1 square: 1 -1.25,-0.525 | drill 1: 2 1.25,-0.525
1X03 = drill 1.016 long: 1 -2.54,0; 2 0,0; 3 2.54,0
1X02 = drill 1.016 long: 1 -1.27,0; 2 1.27,0
1X05 = drill 1.016 long: 1 -5.08,0; 2 -2.54,0; 3 0,0; 4 2.54,0; 5 5.08,0
0805 = smd 0.8 x 1.2: 1 -0.9,0; 2 0.9,0
DR73 = smd 2.5 x 3.25: 1 -3,0; 2 3,0
PLCC2 = smd 2.6 x 1.5: A 0,1.7; C 0,-1.7
HC49UP = smd 5.334 x 1.93: 1 -4.826,0; 2 4.826,0
8.2X3.8 = smd 1.3 x 1.9: 1 -2.75,-1.6; 2 2.75,-1.6; 3 2.75,1.6; 4 -2.75,1.6
R0402 = smd 0.6 x 0.7: 1 -0.5,0; 2 0.5,0
R0805 = smd 1.3 x 1.5: 1 -0.95,0; 2 0.95,0
BUZZER = smd 2.2 x 4.2: 1 0,3.5; 2 0,-3.5
SWT6-M = smd 2.489 x 1.397: 1 -3.331,2.25; 2 3.331,2.25; 3 -3.331,-2.25; 4 3.331,-2.25
MICRO3 = smd 0.8 x 0.9: 1 -0.95,-1; 2 0.95,-1; 3 0,1
SOT23 = smd 1 x 1.4: 1 -0.95,-1.1; 2 0.95,-1.1; 3 0,1.1
SOT23-BEC = smd 1 x 1.4: B -0.95,-1.1; C 0,1.1; E 0.95,-1.1
TRANSFORMER = drill 1 pad 1.778 octagon: 1 -9,9; 2 -9,-9; 3 9,9; 4 9,-9 | drill 1 pad 1.778: P$5 0,1.8; P$6 0,-1.8; P$7 1.8,0; P$8 -1.8,0 | drill 1 pad 1.676: P$9 0,11.2; P$10 0,-11.2; P$11 11.2,0; P$12 -11.2,0
XH-B3B = drill 1 octagon: A 2.45,2.35; K 7.45,2.35
SOIC127P600X175-8N = smd 1.422 x 0.533: 1 -2.794,1.905; 2 -2.794,0.635; 3 -2.794,-0.635; 4 -2.794,-1.905; 5 2.794,-1.905; 6 2.794,-0.635; 7 2.794,0.635; 8 2.794,1.905
QFP50P900X900X160-48N = smd 1.56 x 0.28: 1 -4.18,2.75; 2 -4.18,2.25; 3 -4.18,1.75; 4 -4.18,1.25; 5 -4.18,0.75; 6 -4.18,0.25; 7 -4.18,-0.25; 8 -4.18,-0.75; 9 -4.18,-1.25; 10 -4.18,-1.75; 11 -4.18,-2.25; 12 -4.18,-2.75; 25 4.18,-2.75; 26 4.18,-2.25; 27 4.18,-1.75; 28 4.18,-1.25; 29 4.18,-0.75; 30 4.18,-0.25; 31 4.18,0.25; 32 4.18,0.75; 33 4.18,1.25; 34 4.18,1.75; 35 4.18,2.25; 36 4.18,2.75 | smd 0.28 x 1.56: 13 -2.75,-4.18; 14 -2.25,-4.18; 15 -1.75,-4.18; 16 -1.25,-4.18; 17 -0.75,-4.18; 18 -0.25,-4.18; 19 0.25,-4.18; 20 0.75,-4.18; 21 1.25,-4.18; 22 1.75,-4.18; 23 2.25,-4.18; 24 2.75,-4.18; 37 2.75,4.18; 38 2.25,4.18; 39 1.75,4.18; 40 1.25,4.18; 41 0.75,4.18; 42 0.25,4.18; 43 -0.25,4.18; 44 -0.75,4.18; 45 -1.25,4.18; 46 -1.75,4.18; 47 -2.25,4.18; 48 -2.75,4.18
SOT95P280X145-5N = smd 1.27 x 0.559: 1 -1.295,0.94; 2 -1.295,0; 3 -1.295,-0.94; 4 1.295,-0.94; 5 1.295,0.94
SOT223 = smd 1.499 x 2.007: 1 -2.261,-3.15; 2 0.025,-3.15; 3 2.311,-3.15 | smd 3.81 x 2.007: 4 0,3.15
TSSOP8 = smd 0.9 x 0.35: 1 -2.875,0.975; 2 -2.875,0.325; 3 -2.875,-0.325; 4 -2.875,-0.975; 5 2.875,-0.975; 6 2.875,-0.325; 7 2.875,0.325; 8 2.875,0.975
SO08 = smd 0.66 x 2.032: 1 -1.905,-3.073; 2 -0.635,-3.073; 3 0.635,-3.073; 4 1.905,-3.073; 5 1.905,3.073; 6 0.635,3.073; 7 -0.635,3.073; 8 -1.905,3.073
DS1092-10-W6L = smd 5 x 4.6: + 30.8,1.8; - 1.5,1.8
12864-06D = drill 1.016 pad 1.524 long: 1 15.66,44.15; 2 18.2,44.15; 3 20.74,44.15; 4 23.28,44.15; 5 25.82,44.15; 6 28.36,44.15; 7 30.9,44.15; 8 33.44,44.15; 9 35.98,44.15; 10 38.52,44.15; 11 41.06,44.15; 12 43.6,44.15; 13 46.14,44.15 | hole 3: 1.75,1.65; 1.75,44.15; 60.05,44.15; 60.05,1.65
32005-201 = smd 3.1 x 0.5: 1 3,1.6; 2 3,0.8; 3 3,0; 4 3,-0.8; 5 3,-1.6 | smd 2.5 x 2: M1 -3,-4.45; M2 -3,4.45 | smd 3.3 x 2: M3 2.9,4.45; M4 2.9,-4.45 | hole 0.9: 0,2.2; 0,-2.2

### Placement (x,y rotation side)
C1  4.72,42.17 90 top
C2  3.68,35.22 180 top
C3  9.22,36.93 0 top
C4  8.07,39.87 90 top
C5  51.5,4.5 90 top
C6  51.5,12.5 90 top
C8  63.92,27.36 0 top
C9  20.36,5.1 90 top
C10  13.96,5.1 90 top
C11  16.93,6.98 270 top
C12  65.5,13 270 top
C13  65.5,21 90 top
C15  56.43,33.83 270 top
C16  65.5,4.5 270 top
C17  58.5,21 90 top
C18  13.32,16.43 0 top
C19  19.97,14.07 90 top
C20  25.57,42.62 90 top
C21  28.64,44.76 270 top
C22  18.14,44.65 270 top
C23  21.27,49.93 0 top
C24  30.28,67.53 270 top
C25  20.78,67.11 270 top
C26  48.07,59.42 90 top
C27  50.5,58.5 0 top
C28  30.78,62.07 180 top
C29  50.37,48.43 0 top
C30  39.57,60 90 top
C31  33.33,49.57 180 top
C32  44.93,44.68 270 top
C33  38.22,60 90 top
C34  50.5,54.5 0 top
C35  50.5,56 0 top
C36  50.5,53 0 top
C37  63,53 180 top
C38  54.5,48.75 180 top
C39  37.38,83.07 180 top
C40  54.5,50 180 top
C41  56,53 0 top
C42  37.5,32.5 0 top
C43  27.5,32.5 0 top
C44  47.5,32 0 top
C45  37.5,42 0 top
C46  32,32.5 0 top
D1  58.5,3 180 top
D2  58.5,6 0 top
D3  58.5,9 180 top
D4  58.5,12 0 top
D5  58.5,15 180 top
D9  11.51,22.83 270 top
D10  9.49,29.32 90 top
D11  57.37,39.16 90 top
D12  10,65.37 180 top
J1  3.5,30 90 top
JP1  72,62.76 270 top
JP3  72,80 270 top
JP6  72,71.96 270 top
JP7  72,51.02 270 top
L1  8.61,1.86 0 top
L2  21.76,36.84 180 top
L3  41.14,60.3 90 top
L4  48.51,62.14 180 top
L5  15,44.5 90 top
LED1  4,80.5 180 bottom
Q1  60.36,57.39 0 top
Q2  59.28,47.21 270 top
R1  2.08,42.58 270 top
R2  19.75,27.76 0 top
R3  12.12,28.45 90 top
R4  3.64,23.74 180 top
R5  51.5,23 180 top
R6  50,19 90 top
R7  53,19 90 top
R8  63.44,33.77 180 top
R9  9.5,4.24 180 top
R10  64.67,40.23 0 top
R11  10.26,39.98 270 top
R12  9,7.24 180 top
R13  71.5,24 180 top
R14  71.5,21.5 0 top
R15  71.5,19 180 top
R16  69.17,27.54 180 top
R17  7.78,18.23 0 top
R18  64.11,32.27 180 top
R19  54.27,34 90 top
R20  18.61,20.12 180 top
R21  14.89,18.77 180 top
R22  8.76,33.24 0 top
R23  18.72,84.73 0 top
R24  21.5,71 90 top
R25  17.77,77.33 90 top
R26  25.06,77.27 180 top
R27  21.5,78.53 270 top
R28  60.73,38.45 270 top
R29  4.84,62.27 180 top
R30  51.92,37.74 180 top
R31  47.69,41.76 0 top
R32  8.77,62.23 0 top
R33  40.39,68.62 180 top
R34  16.26,70.65 270 top
R35  13.38,67.73 0 top
R36  68.88,81.72 270 top
R37  4.12,80.72 90 top
R39  13,55.25 180 top
R40  13,54 180 top
R41  28.54,77.74 180 top
R42  34.88,80.55 270 top
R43  37,68 90 top
R44  32.62,81.83 90 top
R45  37,79.5 0 top
R46  36.5,29.5 270 top
R47  26.5,29.5 270 top
R48  46.5,29.5 270 top
R49  36.5,39.5 270 top
R50  31,29.5 270 top
R51  38.5,29.5 270 top
R52  28.5,29.5 270 top
R53  48.5,29.5 270 top
R54  38.5,39.5 270 top
R55  33,29.5 270 top
SG1  6.08,71.66 0 top
SW1  37.5,30 180 bottom
SW2  37.5,40 0 bottom
SW3  37.5,20 270 bottom
SW4  47.5,30 180 bottom
SW5  27.5,30 180 bottom
SW6  58.5,39.5 0 bottom
T1  19.96,30.59 0 top
T2  15.75,28.56 270 top
T3  14.22,39.09 0 top
T4  13.48,32.69 0 top
T5  3.76,18.91 180 top
T6  7.51,22.25 0 top
T7  59.75,33.62 270 top
T8  20.25,23 270 top
T9  15.75,23 90 top
T10  19,81.41 180 top
T11  24.15,81.25 0 top
T12  52.1,40.25 0 top
T13  47.28,38.75 180 top
T14  13.22,71.14 0 top
T15  28.75,81.5 270 top
T16  31.6,76.64 0 top
T18  65.02,36.75 180 top
TR1  33.14,13.7 0 top
TUBE  69,17 270 top
U1  30.61,58.19 0 top
U2  42.18,52.31 180 top
U3  3.11,38.6 90 top
U4  25.63,67.16 0 top
U5  22.14,44.58 270 top
U6  14.42,12.46 90 top
U$1  69,76 180 top
U$5  68.4,43.27 0 bottom
X1  5.33,54.19 0 top

### Tracks (layer width: path | path; a pad name or v marks a point on that pad's centre or on a via)
+3V3  (via drill 0.4)
  Top 0.28: U1.7 33.4,59.5 | 33.4,59.5 U1.8 33.4,61.1 | 33.4,61.1 32.43,62.07 C28.1 30,60.64 v30,60.5 | U1.3 27.87,57.5 28.5,57.5 v29.5,56.5 | v31,59.5 33.4,59.5 | R8.1 63.94,37.72 T18.E 64.07,40.13 R10.1 64.17,41.17 65,42 v67,42 73,42 73.84,42.84 73.84,52.5 72.78,53.56 JP7.2 73.06,53.56 73.84,54.34 73.84,77.5 72.61,78.73 JP3.2 | C25.1 21.5,67.76 | 21.5,67.76 24.24,67.76 25.66,66.34 U4.2 25.5,63.85 v25.5,62 | 21.5,67.76 R24.1 22.02,70.5 27.65,76.13 27.65,78.13 | T15.E 27.65,79.5 | 27.65,79.5 27.65,78.13 | 27.65,78.13 R41.2 | U$5.6 38.03,85.41 C39.1 38,83.04 v38,81.5 | L3.2 41.22,61.28 | 41.22,61.28 42.47,62.52 47.23,62.52 L4.2 | v29.5,79.5 27.65,79.5 | v31,41.5 v31,37.5 | R28.1 60,39.68 v60,40 | 33.4,61.1 33.5,61 v36.5,61 | v38.25,61.9 40.6,61.9 41.22,61.28
  Bottom 0.28: SW4.4 SW4.3 SW1.4 | SW3.4 SW3.3 39.75,24.75 41,26 42,26 42.5,26.5 42.5,30 43.5,31 50,31 50.83,31.83 SW4.4 | SW5.3 SW5.4 SW1.3 | SW1.4 SW1.3 | SW1.3 34.17,37.5 | 34.17,37.5 SW2.4 SW2.3 SW1.4 | v29.5,56.5 29.5,58 v31,59.5 | v38,81.5 31.5,81.5 v29.5,79.5 | v30,60.5 27,60.5 v25.5,62 25.5,49 22.5,46 22.5,44 24.5,42 30.5,42 v31,41.5 | v31,37.5 34.17,37.5 | SW4.4 50.83,37.33 54,40.5 60,40.5 | v67,42 65.5,40.5 60,40.5 | v60,40 60,40.5 | v36.5,61 37.5,62 38,62 38.1,61.9 v38.25,61.9
+5V  (via drill 0.4)
  Top 0.28: D10.2 9.49,32.8 9.16,33.12 R22.2 | D10.2 12.14,31.3 T4.1 | D10.2 5.19,27 2.16,27 1.16,28 1.16,38.16 1.5,38.5 2.65,38.5 U3.4 4.05,40.85 C1.1 5.74,40.5 v6.5,40.5 | X1.1 9.79,55.79 v11,57 | v4.5,60.5 4.34,60.66 R29.2
  Bottom 0.28: v6.5,40.5 9,40.5 11.5,43 11.5,56.5 v11,57 7.5,60.5 v4.5,60.5
+5V/2  (via drill 0.4)
  Top 0.28: C24.1 30.1,68 28.5,68 28,67.5 | 28,67.5 28,64.5 27.94,64.44 U4.3 | 6.5,67 9,64.5 9.87,64.5 D12.3 11.37,64.37 12.5,65.5 v13.5,65.5 | 6.5,67 6.08,67.42 | v26.5,67.5 28,67.5 | v26,40.5 26,41.46 26.04,41.5 | SG1.2 6.5,67.74 6.5,67
  Top 0.305: 23.3,41.5 23.32,41.5 U5.8
  Top 0.61: T5.2 2.81,21.31 3.14,21.64 R4.2 3.13,23.75 3.13,25.02 4.1,26 23,26 23,32.5 24.5,34 27,34 27.75,34.75 27.75,41.75 | 23.3,41.5 25.1,41.5 | 25.1,41.5 C20.1 26.04,41.5 | C21.+ 28.14,42.13 27.75,41.75 | 27.75,41.75 27.5,41.5 26.04,41.5 | 25.1,41.5 26.04,41.5
  Bottom 0.28: v26.5,67.5 24.5,65.5 v13.5,65.5 13.5,59.5 16,57 18.5,57 20.5,55 20.5,44 24,40.5 v26,40.5
+12V  (via drill 0.4)
  Top 0.28: T1.3 18.41,31.59 16,34 16,39.5 15.41,40.09 T3.3 13.63,39.5 v12.5,39.5
  Bottom 0.28: J1.2 12.28,39.5 v12.5,39.5
GND  (via drill 0.4, 0.8)
  Top 0.28: C16.2 65.95,1.95 71.5,7.5 71.5,9.4 TUBE.K | v59,25.5 59,24.05 C17.2 | C36.2 C34.2 C35.2 C27.2 51.15,58.85 50.45,59.55 | U2.23 39.93,53.57 41.5,52 | 41.5,52 39.56,50.06 U2.35 35.44,50.06 35,50.5 29.5,50.5 28.5,49.5 28.5,47.5 28.63,47.37 | 42,51.5 42,51.66 44.06,51.66 45.46,53.06 U2.8 | U2.47 44.43,50.07 43,51.5 42,51.5 | T7.2 56.94,32.67 C15.2 54.59,33.18 R19.1 52.5,33.5 50,36 44,36 | 14.17,68.02 14.83,67.98 15.65,67.21 15.65,60.5 | 14.17,68.02 T14.2 | C42.2 v38.15,31 38.15,30.35 R51.1 | C46.2 v32.65,31 32.65,30.35 R55.1 | C43.2 v28.15,31 28.15,30.35 R52.1 | R53.1 48.15,30.35 C44.2 48.15,33.35 48,33.5 44,33.5 | 44,33.5 43.5,33.5 41,31 v41,30.5 | C37.2 60,53 | 60,53 C41.2 | R3.1 12.8,27.95 v13.3,27.45 14.49,27.45 T2.2 | R11.1 10.22,40.52 C4.2 | U3.2 3.03,37.23 C2.2 2.22,35.22 2,35 2,30 3.25,28.75 J1.1 4.25,28.75 4.5,28.5 6,30 6,33.25 | R1.1 4.46,43.08 C1.2 5.77,42.82 C4.2 | C22.- 12.82,52.59 X1.5 | C4.2 8.02,40.52 6,38.5 6,33.25 | C22.- 13.28,47.27 12,46 12,42.5 11.5,42 9,42 8.07,41.07 C4.2 | R22.1 6,33.25 | 26.5,61 27.57,62.07 C28.2 30.13,63.5 | 26.5,61 26.5,57 27.21,56.28 U1.4 | 50.45,59.55 50,60 48.14,60 C26.2 46.38,60.07 46.36,60.09 46.36,60.86 46.5,61 45.41,62.09 43.59,62.09 42,60.5 39.72,60.5 C30.2 | C31.2 30.82,49.57 C21.- | C21.- 28.63,47.37 | 28.63,47.37 25.57,44.31 | 25.57,44.31 C20.2 22.27,43.27 21.82,42.81 U5.6 | 25.57,44.31 25.57,46.43 24.5,47.5 24.45,47.45 U5.1 23.11,49.38 22.57,49.93 C23.2 22,50.01 22,51.5 21.5,52 19,52 18.14,51.14 C22.- | 46.33,40.9 T13.2 44,37.52 44,37 | 46.33,40.9 R31.1 | 44,37 44,36 | 44,36 44,33.5 | C32.2 46.33,42.63 | 46.33,42.63 46.33,41.5 | 46.33,41.5 46.33,40.9
  Top 0.28: 44,37 43,37 42.5,37.5 42.5,38 40.5,40 R54.1 38.15,40.35 C45.2 38.15,43.35 36,45.5 33.5,45.5 32.5,44.5 31.52,44.5 C21.- | 20.36,61 U4.1 23.23,64.01 C25.2 | 18.5,60.5 19.86,60.5 20.36,61 | 18.5,60.5 15.65,60.5 | 15.65,60.5 8.5,60.5 | 8.5,60.5 7,60.5 | 7,60.5 3.5,57 3.5,54.5 4.4,53.6 6,53.6 6.2,53.39 X1.4 | R32.1 8.27,60.73 8.5,60.5 | 14.17,68.02 R35.2 | C24.2 30.13,66.73 30.13,64.5 | 30.13,64.5 30.13,63.5 | 20.36,61 26.5,61 | 30.13,64.5 31.5,64.5 32.55,65.55 T16.2 32.55,75.05 32.36,75.36 R45.1 36.5,82.84 C39.2 36.73,86.87 37.28,87.42 U$5.7 | T11.2 25.1,80 | 25.1,80 25.1,79.4 25.56,78.94 25.56,78 | 25.56,78 R26.1 25.65,77.18 25.65,75.3 24.48,74.13 20.42,74.13 18.5,72.21 18.5,60.5 | R27.2 25.53,78.03 25.56,78 | C29.2 51.02,47.52 51,47.5 48,47.5 46.33,45.83 46.33,42.63 | 60,53 60,59.5 59.95,59.55 | 59.95,59.55 59.5,60 | 59.95,59.55 50.45,59.55 | C30.2 39.92,61 | C30.2 C33.2 35.37,63.5 30.13,63.5 | JP1.1 64.8,65.3 59.59,60.09 | JP7.1 69.3,58.8 | 69.3,58.8 68.1,60 59.5,60 | JP6.1 67.94,74.5 67.72,74.72 | 67.72,74.72 67.16,75.29 62.29,75.29 59.59,72.59 | 59.59,72.59 59.59,60.09 | 59.5,66.66 59.5,60 | R36.1 63.72,82.22 59.59,78.09 59.59,72.59 | C40.1 C38.1 58.75,48.75 59.35,49.35 59.35,50.7 60.15,51.5 66.5,51.5 69.3,54.3 69.3,58.8 | 25.1,80 26,80 26.5,80.5 26.5,83 28.5,85 31.5,85 32.42,85.92 U$5.9 | v6.65,61.25 7,60.9 7,60.5 | 41.5,52 42,51.5 | v45,41.5 46.33,41.5 | 59.5,60 59.59,60.09 | U$1.- 67.5,74.5 67.72,74.72
  Top 0.406: X1.5 X1.4
  Top 0.61: C11.2 16.93,2.48 | 19,14.37 19.61,14.37 | 19.61,14.37 C19.2 | 19,14.37 U6.4 15.84,16.02 | 19.61,14.37 20.77,14.37 21.4,14.99 24.5,14.99 27.5,12 27.5,3.5 | 19.5,2.44 26.45,2.44 27.5,3.5 | 15.84,16.02 15.43,16.43 C18.2 | R21.1 15.84,16.02 | 19,14.37 19.11,14.47 R20.1 19.11,20.5 | 19.11,20.5 19.11,22.01 T8.2 | 8.46,18.41 T6.2 8.46,21.46 10,23 T9.C | 8.46,18.41 R17.2 | 27.5,3.5 28.7,4.7 TR1.4 | C10.- 12.47,2.48 v12,2 | v8.5,15.5 8.46,15.54 8.46,18.41 | v21,20.5 19.11,20.5
  Top 1.016: C10.- 16.93,2.48 | C9.- 20.33,2.44 19.5,2.44 16.93,2.44
  Bottom 0.28: TR1.4 42.17,4.67 | 42.17,4.67 45.34,1.5 65,1.5 71.5,8 71.5,9.4 TUBE.K | v41,30.5 39,30.5 38.5,31 v38.15,31 | 38,31 v38.15,31 | v38.15,31 v32.65,31 v28.15,31 28,31 | v59,25.5 55.66,22.16 46.02,22.16 42.17,18.3 42.17,4.67 | SW6.1 SW6.2 45.25,41.75 v45,41.5 | LED1.C 2.2,82.2 1.5,81.5 1.5,66.5 6.65,61.35 v6.65,61.25 | J1.1 5.25,28.75 7,27 12.85,27 v13.3,27.45
  Bottom 0.61: v12,2 8.5,5.5 v8.5,15.5 | v21,20.5 18.5,23 10,23 8.5,21.5 v8.5,15.5 | v8.5,15.5 8.5,24.27 J1.1
  other vias: 46.5,77
  pour Top (isolate 0.254): 2,90 73,90 75,88 75,31.5 74,30.5 40,30.5 29.5,20 29.5,2 27.5,0 2,0 0,2 0,88
  pour Bottom: 0,87.5 2.5,90 73,90 75,88 75,34 71.5,30.5 42.5,30.5 29.5,17.5 29.5,3 26.5,0 2,0 0,2
N$1  (via drill 0.4)
  Top 0.254: U2.24 39.43,59.21 | 39.43,59.21 C30.1 | 39.43,59.21 38.36,59.21 C33.1 | U2.36
  Top 0.28: C30.1 41.09,59.35 L3.1 35.9,59.4 v35.5,59 | C31.1 34,49.56 | 34,49.56 U2.36 | U2.48 44.93,47 | 44.93,47 C32.1 | v35,48.5 34,49.5 34,49.56 | v46,47 44.93,47
  Bottom 0.28: v35.5,59 35.5,49 v35,48.5 35,47.3 35.6,46.7 45.7,46.7 v46,47
N$2
  Top 0.28: Q1.1 55.35,57.57 C41.1 54,53 53.06,52.06 U2.6
N$3  (via drill 0.4)
  Top 0.28: U2.9 48.06,53.56 49,54.5 C34.1 C35.1 50.05,56.2 v50.05,57.19 v50.05,57.2 | L4.1 49.41,62.09 51,60.5 v51,60.4
  Bottom 0.28: v51,60.4 51,57.5 50.69,57.19 v50.05,57.19
N$4
  Top 0.28: U2.5 53.95,51.56 54.32,51.93 63.43,51.93 63.65,52.15 C37.1 63.65,58.15 64,58.5 64.08,58.5 Q1.2
N$5
  Top 0.28: U2.3 51.44,50.56 53.25,48.75 C38.2 53.85,48.15 54.5,47.5 58.42,47.5 Q2.4
N$6
  Top 0.28: U2.7 49.06,52.56 49.5,53 C36.1
N$7
  Top 0.28: U2.4 52.94,51.06 53.85,50.15 C40.2 53.85,50.85 54,51 57.68,51 Q2.1
N$8  (via drill 0.4)
  Top 0.28: C29.1 49.72,49.56 U2.1 46.36,48.64 v46.5,48.5 | v46.5,67 42.56,67 42.48,67.03 R33.1
  Bottom 0.28: v46.5,67 46.5,60.61 42.87,56.98 42.87,52.15 46.5,48.52 v46.5,48.5
N$9  (via drill 0.4)
  Top 0.28: R36.2 71.95,81.22 | 71.95,81.22 JP3.1 | U2.44 42.93,49.33 43.35,49.75 v43.35,49.8 | v48.5,73.5 58.5,83.5 71,83.5 72,82.5 71.95,82.45 71.95,81.22
  Bottom 0.28: v43.35,49.8 43.35,51.05 42.44,51.97 42.44,57.16 45.5,60.22 45.5,70.5 v48.5,73.5
N$10
  Top 0.28: R33.2 39.89,72.51 U$1.+
N$11
  Top 0.28: R40.1 23.39,54 26.33,51.06 U2.33
N$12
  Top 0.28: R39.1 22.75,55.25 26.44,51.56 U2.32
N$13
  Top 0.28: X1.2 12.24,54.99 R39.2
N$14
  Top 0.28: X1.3 12.31,54.19 R40.2
N$15  (via drill 0.4)
  Top 0.28: R2.2 20.91,28.42 T1.2 20,30.5 17.5,30.5 15.3,32.7 11.8,32.7 9.5,35 8.5,35 v7,36.5 | U3.3 4.33,37.02 C2.1 5,35.89 5,36.2 v5.3,36.5
  Bottom 0.28: v5.3,36.5 v7,36.5
N$16  (via drill 0.4)
  Top 0.28: T13.1 48.19,39.89 R31.2 49.43,43 v50.3,43 | U2.19 41.93,55.57 43.7,53.8 44.95,53.8 v44.95,53.75
  Bottom 0.28: 45.1,53.6 v44.95,53.75 61.25,53.75 64,51 64,46.03 63.99,46.02 63.99,44.14 62.9,43.05 50.5,43.05 50.45,43 v50.3,43
N$17
  Top 0.28: T13.3 51.33,37.65 R30.2 51.42,38.98 | 51.42,38.98 T12.1 | 51.42,38.98 51.42,39.92 51.85,40.35 58.13,40.35 D11.2
N$18  (via drill 0.4)
  Top 0.28: D11.3 56.21,39 v55,39
  Bottom 0.28: v55,39 55.17,38.83 SW6.4 SW6.3
N$19  (via drill 0.4)
  Top 0.28: U2.18 42.43,55.68 43.46,54.66 44.1,54.66 v44.1,54.6 | 61.95,39.55 v62,39.5 62,38.5 61.45,37.95 R28.2 58.63,37.95 D11.1
  Bottom 0.28: v44.1,54.6 44.2,54.5 65.5,54.5 69.31,50.69 69.31,42.31 66.5,39.5 v62,39.5
N$20  (via drill 0.4)
  Top 0.28: R3.2 12.95,28.95 13.51,29.51 14.55,29.51 | 14.55,29.51 T2.1 | U2.41 41.43,42.93 v39.5,41 | v14.55,30.65 14.55,29.51
  Bottom 0.28: v39.5,41 38,39.5 23.4,39.5 v14.55,30.65
N$21
  Top 0.28: T3.1 10.03,38.09 | C3.2 10.03,37.09 10.03,38.09 | 10.03,38.09 10.03,39.25 R11.2
N$22  (via drill 0.4)
  Top 0.28: D10.1 11,28.85 11,29.5 11.5,30 12.84,30 14.42,31.58 | T4.2 14.32,31.58 14.42,31.58 | T12.2 53.05,38.37 R30.1 52.42,36.58 52.5,36.5 v52.5,35.5 | 14.42,31.58 15.07,31.58 15.8,30.85 15.8,27.9 16.7,27 v17,27 | v26,25.5 28.5,23 34,23 38.5,27.5 51.5,27.5 52.5,28.5 52.5,32 v53,32.5
  Bottom 0.28: v26,25.5 21.15,25.5 19.65,27 v17,27 | v52.5,35.5 53,35 v53,32.5
N$23
  Top 0.61: L1.1 6.5,3.07 6.5,13.5 3.76,16.24 T5.3
N$24  (via drill 0.4)
  Top 0.28: C4.1 8.07,37.43 C3.1 8.57,36 10,36 12.31,33.69 T4.3 15.17,35.38 15.17,36.5 | T3.2 15.17,36.5 | R23.1 18.05,84.56 T10.2 16.5,80.86 16.5,73.5 17.5,72.5 v17.5,63 | v17.5,59.5 v17.5,56 | v14,36.5 15.17,36.5
  Bottom 0.28: v17.5,63 v17.5,59.5 | v17.5,56 17.5,49 14,45.5 v14,36.5
N$25  (via drill 0.4)
  Top 0.406: U6.6 v13.29,13.1 v13.3,13.1 | v11.5,9 10,9
  Top 0.61: R12.1 10.45,6.74 R9.1 10.45,2.8 L1.2 | R12.1 10.44,7.72 C10.+ 14.05,7.63 C11.1 16.93,10.43 17.05,10.55 U6.1 | U6.8 10.55,10.55 10,10 10,9 10,7.29 R12.1
  Bottom 0.406: v11.5,9 11.5,11.3 v13.3,13.1
N$26
  Top 0.28: 60.5,18.45 C17.1 58.1,18.05 R7.1 | D5.C 60.55,18.4 60.5,18.45 | 60.5,18.45 61,18.95 61,20.5 61.5,21 63,21 63.5,21.5 63.5,23.5 65.45,23.5 C13.2 66,23.55 | 67,23 66.45,23.55 66,23.55 | R13.2 66.45,24 66,23.55
N$27  (via drill 1)
  Top 0.61: R9.2 8.55,6.74 R12.2 8,7.29 8,11 8.82,11.82 U6.7 14.18,11.82 v14.5,11.5 | TR1.2 21.11,7.72 C9.+ 20.36,9.86 20.5,10 v20.5,10.5
  Bottom 0.61: v20.5,10.5 15.5,10.5 v14.5,11.5
N$28
  Top 0.61: T5.1 4.71,23.17 | 4.71,23.17 R4.1 | T6.3 4.89,23.35 4.71,23.17
N$29
  Top 0.61: T8.1 18.5,23.95 | 18.5,23.95 T9.E | D9.1 17.64,24.81 18.5,23.95
N$30
  Top 0.61: T8.3 23.84,23 TR1.1
N$31  (via drill 0.4)
  Top 0.28: R17.1 6.56,18.95 T6.1 6.56,21.5 v5.57,22.49 | U2.16 43.43,55.57 43.65,55.35 45.35,55.35 46,56 v46.2,56 | v43.5,29.5 v41.5,29.5
  Bottom 0.28: v46.2,56 46.2,55.8 47.07,54.93 65.68,54.93 69.74,50.87 69.74,42.13 65.3,37.69 65.3,36.3 65.3,35.5 61.46,31.66 53.52,31.66 52.37,30.5 44.5,30.5 v43.5,29.5 | v41.5,29.5 37,29.5 36,30.5 34,30.5 33.7,30.2 16.2,30.2 15,29 7,29 6,30 3,30 2,29 2,24.5 4,22.5 5.5,22.5 5.51,22.49 v5.57,22.49
N$32  (via drill 0.4)
  Top 0.28: v20.5,18.5 31,18.5 37.5,25 43,25 45.66,22.34 47.98,22.34 48.63,23 R5.2 | v14.5,13 14.2,13.3 14.2,13.79 13.62,14.37 U6.5
  Top 0.406: U6.5 11.35,15.85 11.93,16.43 C18.1 12.67,17.5 R21.2
  Bottom 0.28: v20.5,18.5 15,13 v14.5,13
N$33
  Top 0.28: D1.A 54.95,1.5 53.5,1.5 53.05,1.95 C5.1 51.11,2.34 46.02,2.34 45.34,3.02 45.34,8.11 42.14,11.31 TR1.3
N$34  (via drill 0.4)
  Top 0.3: U6.2 16.18,11.82 15.5,12.5 15.5,14.5 v15,14.5 | R20.2 16.85,21.38 T9.B 15.3,20.5 v15,20.5 14.65,20.85 D9.2
  Bottom 0.3: v15,14.5 v15,20.5
N$35
  Top 0.28: R6.2 52.45,22.4 R5.1
N$36
  Top 0.28: R6.1 50.55,18.05 52.45,19.95 R7.2
N$37  (via drill 0.4)
  Top 0.28: v34.25,83.3 33.14,83.3 R44.2
  Bottom 0.28: U$5.8 34.46,86.92 34.46,83.51 v34.25,83.3
N$38  (via drill 0.4)
  Top 0.28: C43.1 26.85,30.35 R47.1 25,30 v24.5,29.5
  Bottom 0.28: v24.5,29.5 24.17,29.17 24.17,28 | 24.17,28 SW5.1 | SW5.2 24.42,27.75 24.17,28
N$39  (via drill 0.4)
  Top 0.28: T11.1 22.62,80.15 R27.1 20.53,79.03 v20,78.5 | v21,73 21,72 R24.2
  Bottom 0.28: v21,73 20,74 v20,78.5
N$40
  Top 0.61: C19.1 19.64,13.1 U6.3
N$41  (via drill 0.4)
  Top 0.28: U2.31 32.44,52.06 v31.5,53 | v37,64 55.5,64 v57.5,66
  Bottom 0.28: v31.5,53 31.5,58.5 v37,64 | v57.5,66 64,66 69.96,71.96 JP6.2
N$42  (via drill 0.4)
  Top 0.28: C27.1 49.85,58.35 v49,57.5 48.65,57.15 48.65,55.15 47.56,54.06 U2.10 | R25.1 24,76.83 | 24,76.83 24.12,76.83 R26.2 | v53.5,66 35.5,66 v35,66.5 | v24,75.5 24,76.83
  Bottom 0.28: v49,57.5 49,59.39 51.61,62 52.5,62 53.5,63 v53.5,66 | v35,66.5 26,75.5 v24,75.5
N$43
  Top 0.28: R23.2 19.95,84 T10.1 24.09,82.41 T11.3
N$44
  Top 0.28: T2.3 17.44,28.56 18.5,27.5 18.99,27.5 R2.1 19.25,29.35 T1.1
N$45  (via drill 3.2)
  other vias: 3.5,86.5
N$46
  Top 0.28: D1.C D2.A 61.05,6.5 65.5,6.5 C16.1 C12.2
N$47
  Top 0.28: C6.1 51.5,9.5 | 51.5,9.5 C5.2 | D2.C D3.A 55.95,9.5 51.5,9.5
N$48
  Top 0.28: D3.C D4.A 61,12 62.5,13.5 65,13.5 65.5,14 65.5,15.5 C12.1 C13.1
N$49
  Top 0.28: C6.2 51.55,15 D5.A D4.C
N$50  (via drill 0.4)
  Top 0.28: C44.1 46.85,30.35 R48.1 46,30 45.2,29.2 v45,29.2
  Bottom 0.28: SW4.2 SW4.1 44.17,28.37 v45,29.2
N$51  (via drill 3.2)
  other vias: 71.5,86.5
N$52  (via drill 0.4)
  Top 0.28: U2.12 46.81,55.06 47.3,55.55 v47.3,55.9
  Bottom 0.28: v47.3,55.9 67.68,55.9 JP1.3
N$53  (via drill 0.4)
  Top 0.28: U2.13 45.49,57.05 45.95,57.05 v45.95,57.1 | v51.75,62.75 58.25,62.75 v58.27,62.73 58.5,62.5
  Bottom 0.28: v45.95,57.1 46.05,57 47,57 48.5,58.5 48.5,59.5 v51.75,62.75 v51.76,62.76 | JP1.2 58.76,62.76 58.5,62.5 v58.27,62.73
N$54
  Top 0.28: T10.3 19,79.06 R25.2
N$55  (via drill 0.4)
  Top 0.28: U2.30 33.94,52.56 v32.5,54 | v38,63 41,63 41.5,63.5 57.61,63.5 58.11,64 v58.5,64
  Bottom 0.28: v32.5,54 32.5,58.6 36.9,63 v38,63 | v58.5,64 63.5,64 68.92,69.42 JP6.3
N$56  (via drill 3.2)
  other vias: 3.5,3.5
N$57  (via drill 3.2)
  other vias: 71.5,3.5
N$58
  Top 0.28: R13.1 R14.2
N$59
  Top 0.28: R14.1 R15.2
N$60
  Top 0.28: R15.1 72.45,15.65 TUBE.A
  Bottom 0.28: C8.1 63.24,25.5 69,25.5 71.35,23.15 TUBE.A
N$61
  Top 0.28: C8.2 66.64,27.54 R16.2
N$62
  Top 0.28: R10.2 65.97,39.43 T18.B 66.65,37.85 73.41,31.09 73.41,28.75 72.2,27.54 R16.1
N$63  (via drill 0.4)
  Top 0.28: JP7.5 71.06,45.94 69,48 63.11,48 61.18,46.07 53.07,46.07 v51.5,44.5 | v38.6,44 38.5,44.1 v38.5,47.95 | U2.34 39.06,50.56 v39.5,51
  Bottom 0.28: v51.5,44.5 51,44 v38.6,44 | v39.5,51 39.5,48.95 v38.5,47.95
N$64
  Top 0.28: T18.C 65.02,32.68 R18.1
N$65
  Top 0.28: R19.2 54.29,34.48 C15.1 56.52,34.57 T7.1 59.76,33.46 59.76,32.8 60.29,32.27 R18.2
N$66  (via drill 0.4)
  Top 0.28: R8.2 61,33.77 | 61,33.77 T7.3 | 61,33.77 61,35.5 63,37.5 v63,45 | v44.1,53 43.5,53 41.43,55.07 U2.20
  Bottom 0.28: v63,45 55.5,45 47.5,53 v44.1,53
N$67  (via drill 0.4)
  Top 0.28: JP7.4 62.98,48.48 61,46.5 51.95,46.5 v50.2,44.75 | v39.55,44.75 39.43,44.87 U2.37
  Bottom 0.28: v50.2,44.75 50.05,44.6 39.7,44.6 v39.55,44.75
N$68  (via drill 0.4)
  Top 0.28: JP7.3 71.98,51 64.5,51 60.5,47 50.25,47 v48.7,45.45 | v40.5,45.35 40.43,45.42 U2.39
  Bottom 0.28: v48.7,45.45 48.55,45.45 48.35,45.25 40.6,45.25 v40.5,45.35
N$69
  Top 0.28: U1.5 36.13,53.56 U2.28
N$70
  Top 0.28: U1.2 28.94,58.83 30.92,56.84 34.24,56.84 35.41,55.67 35.41,54.89 36.24,54.06 U2.27
N$71
  Top 0.28: U1.6 33.46,57.5 34.5,57.5 36,56 36,55 36.44,54.56 U2.26
N$72  (via drill 0.4)
  Top 0.28: R54.2 R49.2 35,39 v33.5,40.5 | U2.21 40.93,54.93 40.5,54.5 v40.63,54.5 | v36,47.5 34,47.5 v32,45.5
  Bottom 0.28: v40.63,54.5 40.63,50.64 40,50.01 40,48 39.13,47.13 36.32,47.13 36,47.45 v36,47.5 | v32,45.5 32,41.5 33,40.5 v33.5,40.5
N$73  (via drill 0.4)
  Top 0.28: C46.1 31.35,30.35 R50.1 30.5,30 30,29.5 30,27.5 31,26.5 34.5,26.5 v35,26
  Bottom 0.28: v35,26 35.5,25.5 35.5,23.08 | 35.5,22.5 35.5,23.08 | 35.5,23.08 SW3.1 SW3.2
N$74
  Top 0.28: U1.1 28.79,60.08 30.76,58.11 34.5,58.11 36.43,56.18 36.43,55.57 36.94,55.06 U2.25
N$76  (via drill 0.4)
  Top 0.28: C45.1 36.85,40.35 R49.1 35.5,40 v35,40.5
  Bottom 0.28: SW2.1 SW2.2 34.5,41.92 34.5,41 v35,40.5
N$77  (via drill 0.4)
  Top 0.28: C42.1 36.85,30.35 R46.1 35.5,30 v35,29.5
  Bottom 0.28: v35,29.5 34.67,29.17 34.67,27.75 | SW1.2 34.67,27.75 | 34.42,27.75 34.17,28 SW1.1 34.67,27.75
N$78  (via drill 0.4)
  Top 0.28: U2.11 47.45,54.56 48.14,55.26 48.14,58.7 C26.1 47.3,58 v46.5,58 | R29.1 6,62.93 6,63 6.5,63.5 8.5,63.5 9.27,62.73 R32.2 14.23,62.23 v14.5,62.5 | v52,64.89 37.41,64.89 | 37.41,64.89 37.4,64.9 | 37.41,64.89 35.39,64.89 35.38,64.9 v35.2,64.9
  Bottom 0.28: v46.5,58 46.5,59.39 v52,64.89 52,65 | v14.5,62.5 16.9,64.9 v35.2,64.9
N$79  (via drill 0.4)
  Top 0.28: R46.2 R51.2 39.5,29 40,29.5 v40,39 | U2.43 42.43,40.78 v42.35,40.7
  Bottom 0.28: v40,39 41.7,40.7 v42.35,40.7
N$80  (via drill 0.4)
  Top 0.28: R47.2 R52.2 29.5,29 29.5,33.5 32,36 32,41.5 34.2,43.7 v34.2,44.35 | U2.45 43.43,43.53 43.2,43.3 v43.13,43.3
  Bottom 0.28: v43.13,43.3 35.25,43.3 v34.2,44.35
N$81  (via drill 0.4)
  Top 0.28: R53.2 R48.2 50,29 50.5,29.5 50.5,34 50,34.5 v48,34.5 | U2.46 43.93,39.57 v44,39.5
  Bottom 0.28: v44,39.5 44,37.5 47,34.5 v48,34.5
N$83  (via drill 0.4)
  Top 0.28: R50.2 R55.2 33.5,29 34,29.5 34,34 32.5,35.5 32.5,41 35.8,44.3 v35.8,44.4 | U2.22 40.43,57.57 40,58 v40.1,58.1 v40.11,58.1 | v37.5,48 v37.5,45.5
  Bottom 0.28: v40.11,58.1 37.5,55.49 v37.5,48 | v37.5,45.5 36.4,44.4 v35.8,44.4
N$84  (via drill 0.4)
  Top 0.28: U2.29 35.44,53.06 33.5,55 25,55 22,58 v19,58 | R34.2 16.5,69.91 v16.5,62
  Bottom 0.28: v19,58 17,58 16.5,58.5 v16.5,62
N$85
  Top 0.28: D12.2 9.05,68.48 8.5,69.03 8.5,70.31 9.41,71.23 12.21,71.23 T14.3 13.22,72.28 11.5,74 6.5,74 6.08,74.42 SG1.1
N$86  (via drill 0.4)
  Top 0.28: U$5.1 52.74,78.74 v47,73 | U2.14 44.43,58.63 44.8,59 v44.8,61.2
  Bottom 0.28: v44.8,61.2 44.8,70.8 v47,73
N$87
  Top 0.28: R35.1 12.27,68.34 12.27,70 | 12.27,70 T14.1 | R34.1 16.02,71.13 13.4,71.13 12.27,70
N$88  (via drill 0.4)
  Top 0.28: U$5.5 42.58,71.92 v44,70.5 | U2.15 43.93,60.43 44,60.5 43.95,60.55 v43.85,60.55
  Bottom 0.28: v43.85,60.55 43.85,70.35 v44,70.5
N$89  (via drill 0.4)
  Top 0.28: v41.5,84.5 42.15,83.85 42.15,70.74 42.93,69.96 42.93,68.57 v43,68.5 | v43,59 42.93,58.93 U2.17
  Bottom 0.28: U$5.4 42.2,84.5 v41.5,84.5 | v43,59 v43,68.5
N$90
  Top 0.28: T15.C 30.47,80.88 R44.1
N$91
  Top 0.28: L5.1 16.57,43.6 C22.+ 18.14,37.46 L2.2
N$92
  Top 0.28: T15.B 29.7,84.5 34.5,84.5 35.38,83.62 35.38,81.55 R42.1
N$93
  Top 0.28: R41.1 T16.3 32.57,77.74 R42.2
N$94  (via drill 0.4)
  Top 0.28: U2.40 40.93,49.62 40.8,49.75 v40.85,49.75 | v12,81.5 4.4,81.5 R37.2
  Bottom 0.28: v40.85,49.75 40.85,50.25 41.35,50.75 41.35,66.15 38,69.5 34,69.5 22,81.5 v12,81.5
N$95  (via drill 0.4)
  Top 0.28: R45.2 37.5,78.5 37,78 35.61,78 33.5,75.89 33.5,72 R43.2 35.12,70.38 v35.2,70.45 | T16.1 30.65,74.85 v31.5,74
  Bottom 0.28: v31.5,74 35.05,70.45 v35.2,70.45
N$96  (via drill 0.4)
  Top 0.28: R37.1 2.5,78.6 v2.5,77
  Bottom 0.28: v2.5,77 4,78.5 LED1.A
N$97  (via drill 0.4)
  Top 0.28: U2.38 39.93,49.07 39.5,49.5 39,49 36.65,49 v36.2,48.55 | R43.1 38.5,67.5 v39,67
  Bottom 0.28: v36.2,48.55 36.05,48.7 36.05,58.1 39,61.05 v39,67
N$98  (via drill 0.4)
  Top 0.28: U2.2 45.44,50.06 44.95,50.55 v44.95,51.1
  Bottom 0.28: v44.95,51.1 43.3,52.75 43.3,56.5 43.3,56.8 50.2,63.7 U$5.2
N$99  (via drill 0.4)
  Top 0.28: U2.42 41.93,49.93 v42,50
  Bottom 0.28: U$5.3 42,81.76 v42,50
N$100
  Top 0.28: U3.5 2.17,41.99 R1.2
N$101
  Top 0.28: C23.1 20.62,48.88 21.16,48.34 U5.4
N$105
  Top 0.28: L2.1 22.46,39.13 U5.7
N$108  (via drill 0.4)
  Top 0.28: T12.3 52.1,43.1 v53,44 | v23.5,44.5 17,44.5 16,45.5 15.1,45.5 L5.2
  Bottom 0.28: v53,44 53,44.5 51.3,46.2 25.7,46.2 24,44.5 v23.5,44.5

### Text on the board
tNames: BOOT | UART2 / UART1 | GND / RX / TX | G / V / O / C / I | -